# Altium project EDR_PCB_1.PrjPcb
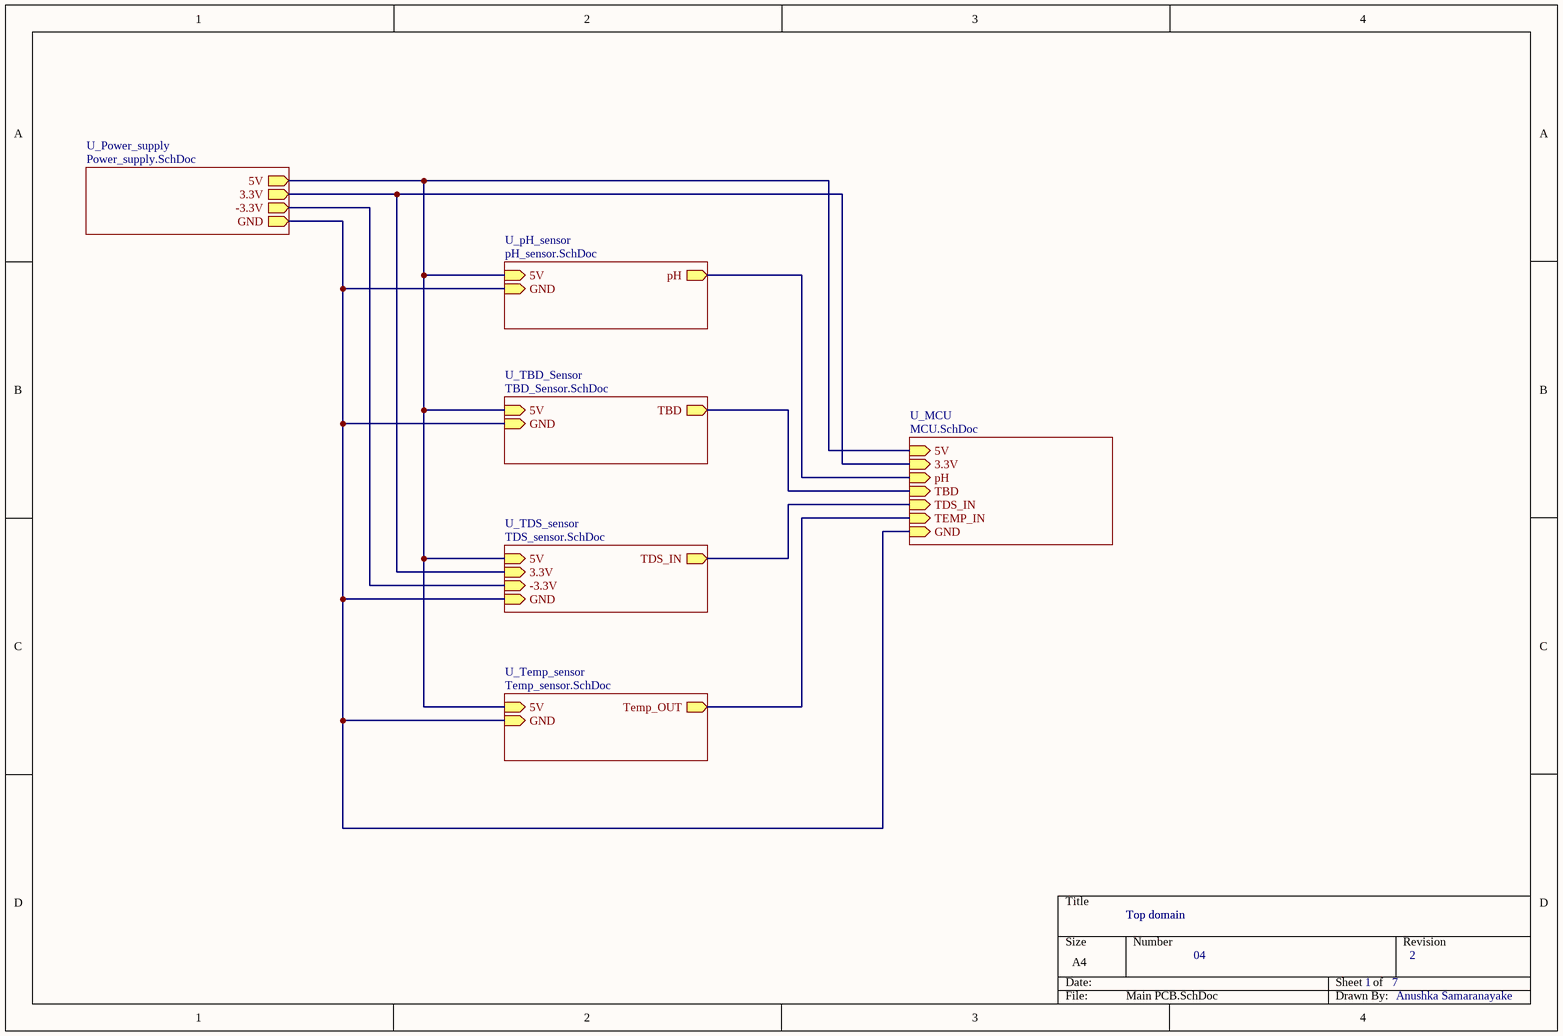
[diagram p0: Main PCB.SchDoc]
7 sheets, 114 parts. Net scope: hierarchical (ports join the sheet entries above them; power ports are global).
Board files: PCB2.PcbDoc, PCB1.PcbDoc
Sheets:
  Main PCB.SchDoc
    U_Power_supply = Power_supply.SchDoc
    U_pH_sensor = pH_sensor.SchDoc
    U_TBD_Sensor = TBD_Sensor.SchDoc
    U_TDS_sensor = TDS_sensor.SchDoc
    U_Temp_sensor = Temp_sensor.SchDoc
    U_MCU = MCU.SchDoc

## Sheet Main PCB.SchDoc
size A4; SheetNumber: 1; SheetTotal: 7

### Sub-sheets
U_MCU = MCU.SchDoc: 3.3V (in), GND (in), TEMP_IN (in), TBD (in), TDS_IN (in), pH (in), 5V (in)
U_pH_sensor = pH_sensor.SchDoc: 5V (in), pH (out), GND (in)
U_Power_supply = Power_supply.SchDoc: 5V (out), 3.3V (out), -3.3V (out), GND (out)
U_TBD_Sensor = TBD_Sensor.SchDoc: TBD (out), 5V (in), GND (in)
U_TDS_sensor = TDS_sensor.SchDoc: TDS_IN (out), 3.3V (in), -3.3V (in), 5V (in), GND (in)
U_Temp_sensor = Temp_sensor.SchDoc: Temp_OUT (out), 5V (in), GND (in)

### Nets
3.3V: sheet U_Power_supply/3.3V, sheet U_TDS_sensor/3.3V, sheet U_MCU/3.3V
5V: sheet U_Power_supply/5V, sheet U_pH_sensor/5V, sheet U_TBD_Sensor/5V, sheet U_TDS_sensor/5V, sheet U_Temp_sensor/5V, sheet U_MCU/5V
-3.3V: sheet U_Power_supply/-3.3V, sheet U_TDS_sensor/-3.3V
GND: sheet U_Power_supply/GND, sheet U_pH_sensor/GND, sheet U_TBD_Sensor/GND, sheet U_TDS_sensor/GND, sheet U_Temp_sensor/GND, sheet U_MCU/GND
p_AOUT: sheet U_pH_sensor/pH, sheet U_MCU/pH
Senser_OUT: sheet U_TBD_Sensor/TBD, sheet U_MCU/TBD
NetC25_2: sheet U_TDS_sensor/TDS_IN, sheet U_MCU/TDS_IN
NetMCU_17: sheet U_Temp_sensor/Temp_OUT, sheet U_MCU/TEMP_IN

### Notes on the sheet
- Top domain
- 04
- 1
- 7
- 2
- Anushka Samaranayake

## Sheet Power_supply.SchDoc
size A4; SheetNumber: 2; SheetTotal: 7
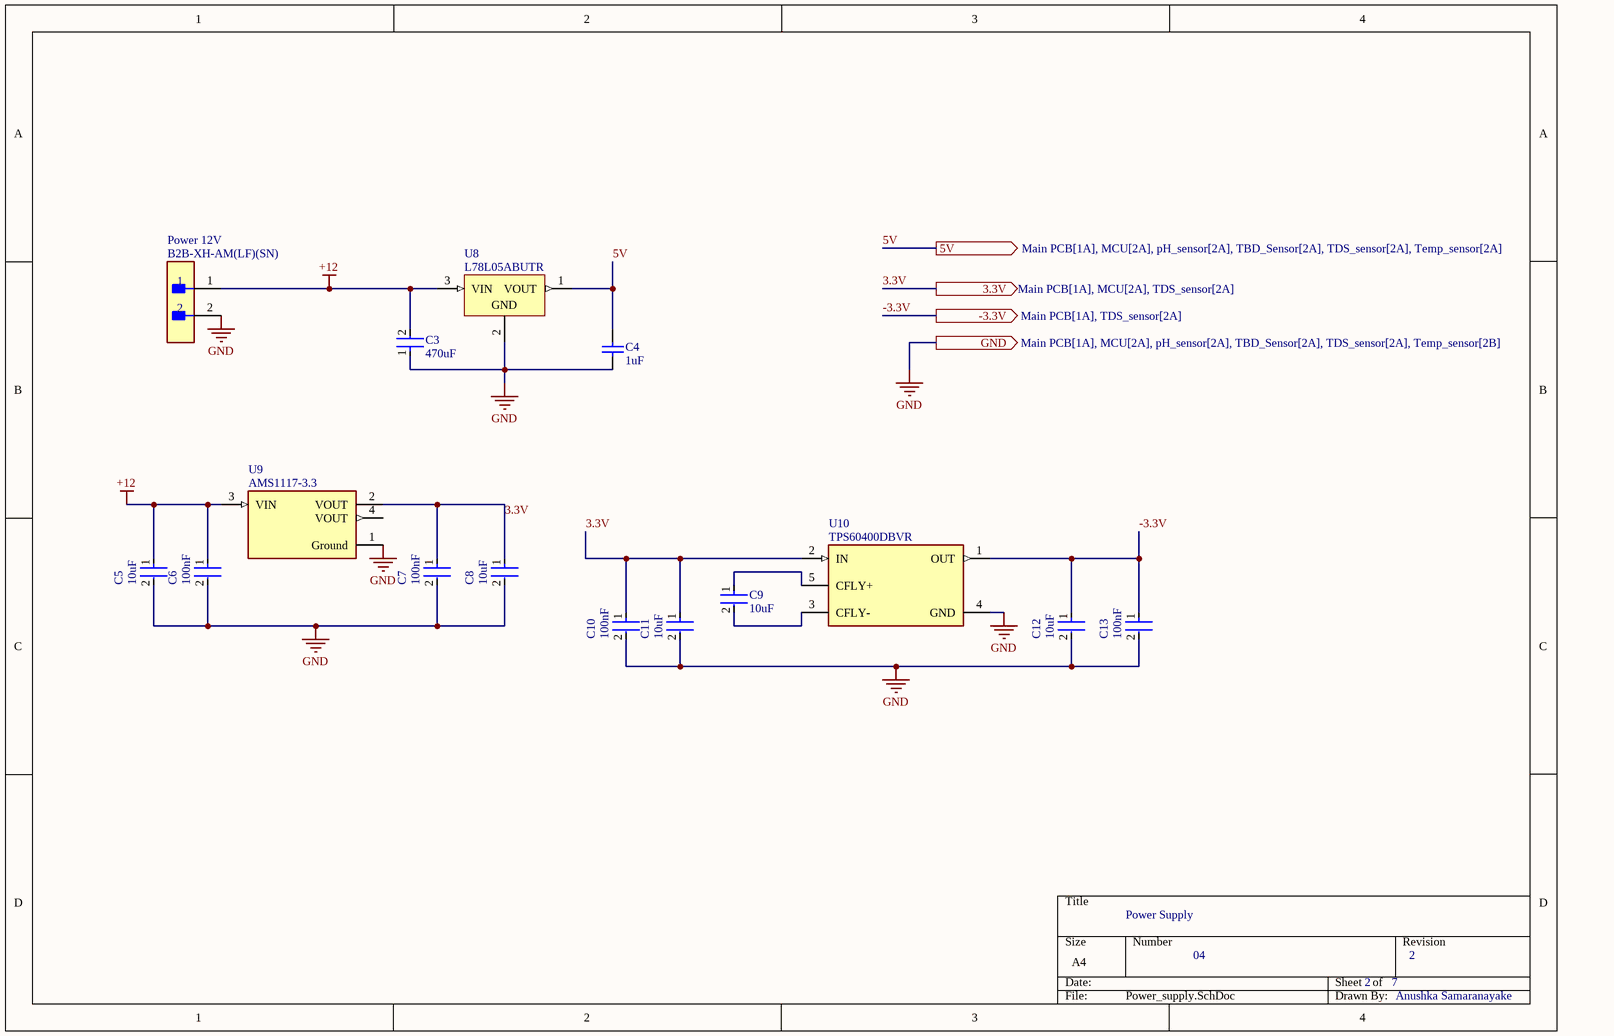
[diagram p1: Power_supply.SchDoc]

### Parts
C3  470uF  [FP-CL31-IPC_B]
C4  1uF  [CAPC2013X135X50LL15T20]
C5  10uF  [FP-CL31-IPC_B]
C6  100nF  [FP-CL31-IPC_B]
C7  100nF  [FP-CL31-IPC_B]
C8  10uF  [FP-CL31-IPC_B]
C9  10uF  [FP-CL31-IPC_B]
C10  100nF  [FP-CL31-IPC_B]
C11  10uF  [FP-CL31-IPC_B]
C12  10uF  [FP-CL31-IPC_B]
C13  100nF  [FP-CL31-IPC_B]
Power_12V  B2B-XH-AM(LF)(SN)  [FP-B2B-XH-AM_LF_SN-MFG]
U8  L78L05ABUTR  [SOT-89_N]
U9  AMS1117-3.3  [FP-AMS1117-IPC_C]
U10  TPS60400DBVR  [FP-DBV0005A-IPC_B]

### Ports
3.3V (out, see Main PCB[1A], MCU[2A], TDS_sensor[2A]), 5V (out, see Main PCB[1A], MCU[2A], pH_sensor[2A], TBD_Sensor[2A], TDS_sensor[2A], Temp_sensor[2A]), -3.3V (out, see Main PCB[1A], TDS_sensor[2A]), GND (out, see Main PCB[1A], MCU[2A], pH_sensor[2A], TBD_Sensor[2A], TDS_sensor[2A], Temp_sensor[2B])

### Nets
3.3V: C7.1 C8.1 C10.1 C11.1 U9.2(VOUT) U10.2(IN) ; port 3.3V
5V: C4.2 U8.1(VOUT) ; port 5V
+12: C3.2 C5.1 C6.1 Power_12V.1 U8.3(VIN) U9.3(VIN)
-3.3V: C12.1 C13.1 U10.1(OUT) ; port -3.3V
GND: C3.1 C4.1 C5.2 C6.2 C7.2 C8.2 C10.2 C11.2 C12.2 C13.2 Power_12V.2 U8.2(GND) U9.1(Ground) U10.4(GND) ; port GND
NetC9_1: C9.1 U10.5(CFLY+)
NetC9_2: C9.2 U10.3(CFLY-)

Not connected (* = marked no-connect by the designer): U9 4(VOUT)

### Notes on the sheet
- Power Supply
- 04
- 2
- 7
- Anushka Samaranayake

### Library data of the parts
C3 C5-C13 = CMP-13271-001731-1: Cap Ceramic 100nF 50V X7R ±10% SMD 1206 +125°C Embossed T/R; Voltage: 50V; Thickness: 0.037inch; Lead Free: Lead Free; Length: 3.2mm; Min Operating Temperature: -55°C; Package Quantity: 15000; Packaging: Tape and Reel; Mount: Surface Mount; Depth: 1.6mm; Case/Package: 1206; Voltage Rating (DC): 50V; Tolerance: 10%; Height: 0.85mm; Capacitance: 100nF; Radiation Hardening: No; Dielectric: X7R; Voltage Rating: 50V; Max Operating Temperature: 125°C; Width: 0.063inch
C4 = CMP-2007-03437-1: Manufacturer: Vitramon; Part Number: VJ0805Y102KXACW1BC
Power_12V = CMP-17439-000037-1: CONN HEADER VERT 2POS 2.5MM; Max Voltage Rating (AC): 250V; Connector Type: Male Pin; Contact Resistance: 20mR; Max Current Rating: 3A; Number of Positions: 2; Series: XH; Contact Material: Brass; Mount: Through Hole; Housing Material: Polyamide; Contact Plating: Tin; Termination: Solder; Max Operating Temperature: 85°C; Depth: 5.75mm; Packaging: Bulk; Min Operating Temperature: -25°C; Contact Type: Male Pin; Color: Green; Pitch: 2.5mm; Length: 7.4mm; Lead Free: Lead Free; Number of Rows: 1; Fastening Type: Detent; Housing Color: White; Orientation: Straight
U8 = CMP-0244-00406-1: Positive Voltage Regulator, 5V, 4-Pin SOT-89, Tape and Reel; PackageVersion: 2011; DatasheetVersion: 1/02/2011; PackageDescription: 3-Pin SOT-89 Package 1.5 mm Pitch, 4.1 mm Lead Span; PackageReference: SOT-89; ComponentLink2Description: Datasheet; ComponentLink1URL: http://www.st.com; ComponentLink1Description: Manufacturer URL; ComponentLink2URL: http://www.st.com/internet/com/TECHNICAL_RESOURCES/TECHNICAL_LITERATURE/DATASHEET/CD00000446.pdf
U9 = CMP-209535-000001-1: LDO Voltage Regulators 1A, 3.3V; Manufacturer: Advanced Monolithic Systems; Dropout Voltage: 1.1V; Output Type: Fixed; Nominal Supply Current: 5mA; Max Power Dissipation: 1.2W; Max Supply Voltage: 15V; Number Of Outputs: 1; Standoff Height: 0.64mm; Max Junction Temp: +125°C; Height: 1.8mm; Package: AMS1117; Device Class L2: Power Management ICs; ComponentLink2Description: Datasheet; ComponentLink2URL: http://www.advanced-monolithic.com/pdf/ds1117.pdf; Category: IC; RoHS: TRUE; Automotive: No; Device Class L1: Integrated Circuits (ICs); Output Current: 1A; Device Class L3: Voltage Regulators - Linear; Temperature: -40°C to +125°C; Output Voltage: 3.3V; Manufacturer Part Number: AMS1117-3.3; Temperature Range Low: -40°C; Octopart: https://octopart.com/ams1117-3.3-advanced+monolithic+systems-25899300; Lead Free: Yes; Ipc Land Pattern Name: SOT229P700X180-4; Temperature Range High: +125°C
U10 = CMP-0391-00019-3: IC REG CHARG PUMP INV 60MA SOT23; Number of Outputs: 1; Min Supply Voltage: 1.8V; Max Supply Voltage: 5.25V; Max Output Voltage: -5.25V; Operating Supply Current: 125uA; Logic Function: Inverting; Min Output Voltage: -1.6V; Output Type: Adjustable; Switching Frequency: 250kHz; Synchronous Rectifier: No; Min Operating Temperature: -40°C; Number of Pins: 5; Package Quantity: 3000; Min Input Voltage: 1.8V; Max Operating Temperature: 85°C; Packaging: Tape and Reel; Output Current: 60mA; Max Input Voltage: 5.25V; Weight: 0.000459oz; Lead Free: Lead Free; Output Voltage: -5.25V; Contact Plating: Gold; Radiation Hardening: No; Quiescent Current: 125uA; Max Output Current: 60mA; REACH SVHC: No SVHC; Case/Package: SOT-23-5

## Sheet pH_sensor.SchDoc
size A4; SheetNumber: 7; SheetTotal: 7
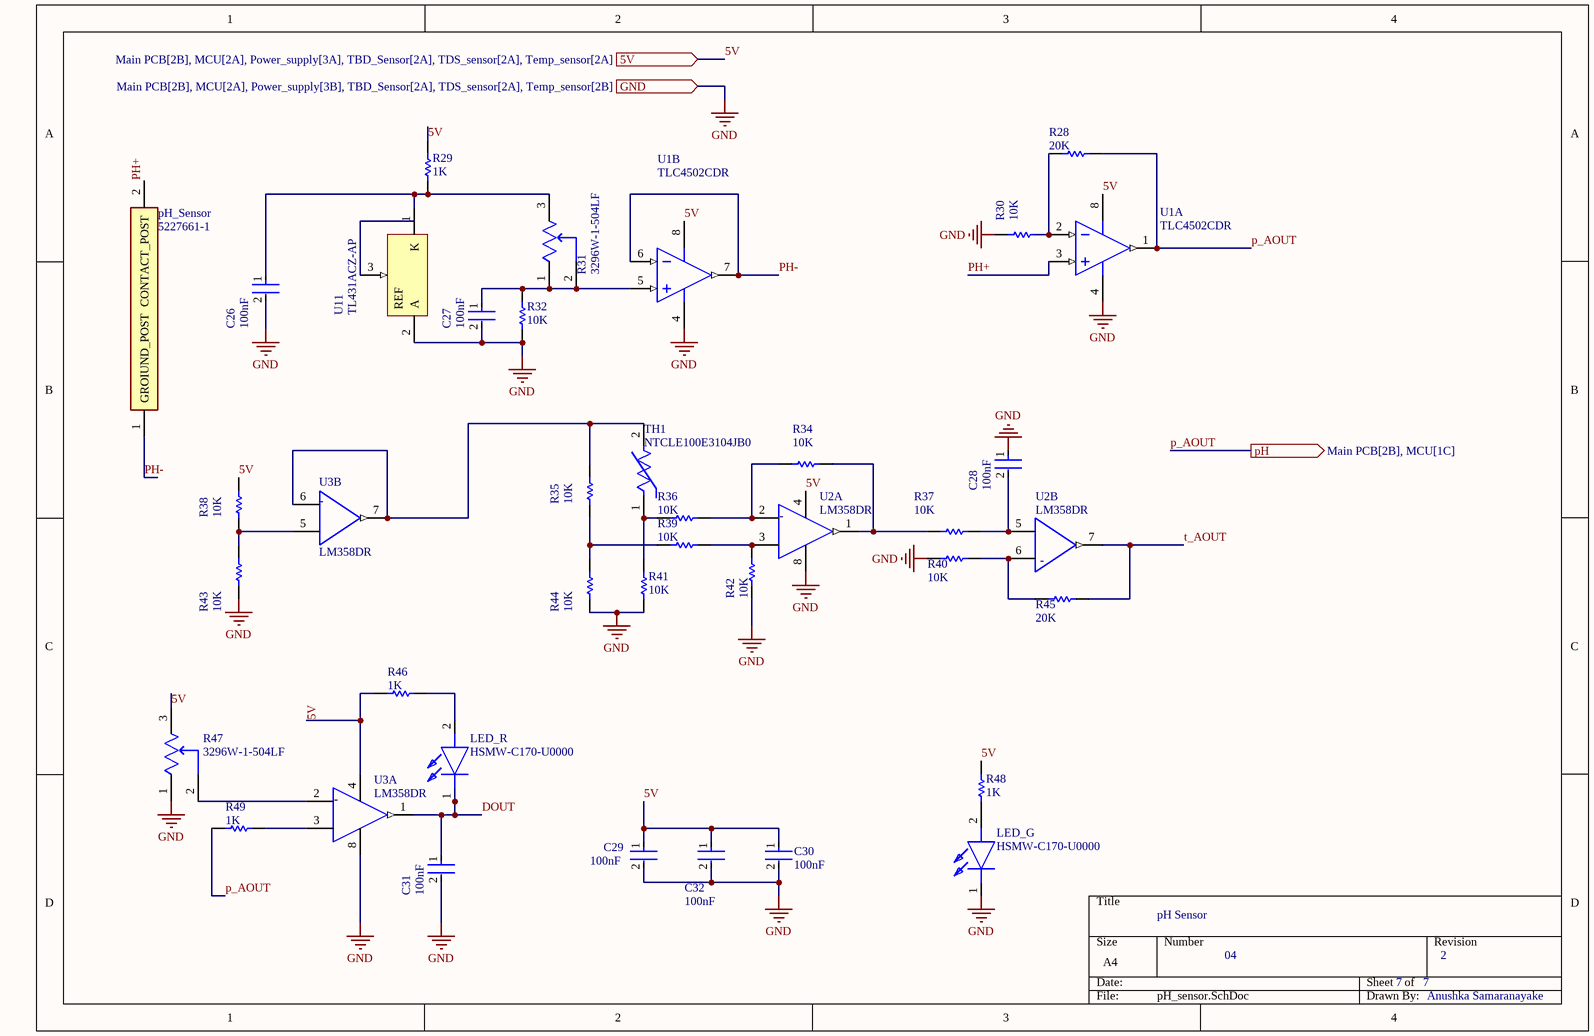
[diagram p2: pH_sensor.SchDoc]

### Parts
C26  100nF  [FP-CL31-IPC_B]
C27  100nF  [FP-CL31-IPC_B]
C28  100nF  [FP-CL31-IPC_B]
C29  100nF  [FP-CL31-IPC_B]
C30  100nF  [FP-CL31-IPC_B]
C31  100nF  [FP-CL31-IPC_B]
C32  100nF  [FP-CL31-IPC_B]
LED_G  HSMW-C170-U0000  [LEDC2012X90N]
LED_R  HSMW-C170-U0000  [LEDC2012X90N]
pH_Sensor  5227661-1  [5227161-1]
R28  20K  [RESC3216X70X50LL20T25]
R29  1K  [RESC3216X70X50ML20T25]
R30  10K  [RESC3216X70X50LL20T25]
R31  3296W-1-504LF  [FP-3296W-MFG]
R32  10K  [RESC3216X70X50LL20T25]
R34  10K  [RESC3216X70X50LL20T25]
R35  10K  [RESC3216X70X50LL20T25]
R36  10K  [RESC3216X70X50LL20T25]
R37  10K  [RESC3216X70X50LL20T25]
R38  10K  [RESC3216X70X50LL20T25]
R39  10K  [RESC3216X70X50LL20T25]
R40  10K  [RESC3216X70X50LL20T25]
R41  10K  [RESC3216X70X50LL20T25]
R42  10K  [RESC3216X70X50LL20T25]
R43  10K  [RESC3216X70X50LL20T25]
R44  10K  [RESC3216X70X50LL20T25]
R45  20K  [RESC3216X70X50LL20T25]
R46  1K  [RESC3216X70X50ML20T25]
R47  3296W-1-504LF  [FP-3296W-MFG]
R48  1K  [RESC3216X70X50ML20T25]
R49  1K  [RESC3216X70X50ML20T25]
TH1  NTCLE100E3104JB0  [FP-NTCLE100E3104JB0-MFG]
U1  TLC4502CDR  [D0008A_M]  (parts A,B of 2)
U2  LM358DR  [FP-D0008A-MFG]  (parts A,B of 2)
U3  LM358DR  [FP-D0008A-MFG]  (parts A,B of 2)
U11  TL431ACZ-AP  [TO-92]

### Ports
5V (in, see Main PCB[2B], MCU[2A], Power_supply[3A], TBD_Sensor[2A], TDS_sensor[2A], Temp_sensor[2A]), GND (in, see Main PCB[2B], MCU[2A], Power_supply[3B], TBD_Sensor[2A], TDS_sensor[2A], Temp_sensor[2B]), pH (out, see Main PCB[2B], MCU[1C])

### Nets
5V: C29.1 C30.1 C32.1 R29.1 R38.2 R46.1 R47.3(CW) R48.1 U1.8(VDD+) U2.4(V-) U3.4(V-) ; port 5V
GND: C26.2 C27.2 C28.1 C29.2 C30.2 C31.2 C32.2 LED_G.1(K) R30.1 R32.1 R40.1 R41.1 R42.1 R43.1 R44.1 R47.1(CCW) U1.4(VDD-/GND) U2.8(V+) U3.8(V+) U11.2(A) ; port GND
DOUT: C31.1 LED_R.1(K) U3.1(1OUT)
p_AOUT: R28.2 R49.1 U1.1(OUT1) ; port pH
PH+: pH_Sensor.2(CONTACT_POST) U1.3(IN1+)
PH-: pH_Sensor.1(GROIUND_POST) U1.6(IN2-) U1.7(OUT2)
t_AOUT: R45.2 U2.7(2OUT)
NetC26_1: C26.1 R29.2 R31.3(CW) U11.1(K)
NetC27_1: C27.1 R31.1(CCW) R31.2(WIPER) R32.2 U1.5(IN2+)
NetC28_2: C28.2 R37.2 U2.5(IN2+)
NetLED_G_2: LED_G.2(A) R48.2
NetLED_R_2: LED_R.2(A) R46.2
NetR28_1: R28.1 R30.2 U1.2(IN1-)
NetR34_1: R34.1 R36.2 U2.2(IN1-)
NetR34_2: R34.2 R37.1 U2.1(1OUT)
NetR35_1: R35.1 R39.1 R44.2
NetR35_2: R35.2 TH1.2 U3.6(IN2-) U3.7(2OUT)
NetR36_1: R36.1 R41.2 TH1.1
NetR38_1: R38.1 R43.2 U3.5(IN2+)
NetR39_2: R39.2 R42.2 U2.3(IN1+)
NetR40_2: R40.2 R45.1 U2.6(IN2-)
NetR47_2: R47.2(WIPER) U3.2(IN1-)
NetR49_2: R49.2 U3.3(IN1+)

Not connected (* = marked no-connect by the designer): U11 3(REF)

### Notes on the sheet
- pH Sensor
- 04
- 7
- 2
- Anushka Samaranayake
- (in symbol CMP-1685-00009-2, part A) -
- (in symbol CMP-1685-00009-2, part B) -

### Library data of the parts
C26-C32 = CMP-13271-001731-1: as C3 on sheet Power_supply; Voltage: 50V; Thickness: 0.037inch; Lead Free: Lead Free; Length: 3.2mm; Min Operating Temperature: -55°C; Package Quantity: 15000; Packaging: Tape and Reel; Mount: Surface Mount; Depth: 1.6mm; Case/Package: 1206; Voltage Rating (DC): 50V; Tolerance: 10%; Height: 0.85mm; Capacitance: 100nF; Radiation Hardening: No; Dielectric: X7R; Voltage Rating: 50V; Max Operating Temperature: 125°C; Width: 0.063inch
LED_G LED_R = HSMW-C170-U0000: LED; Manufacturer_Name: Avago Technologies; Datasheet Link: https://componentsearchengine.com/Datasheets/2/HSMW-C170-U0000.pdf; Height: 0.9mm; Manufacturer_Part_Number: HSMW-C170-U0000; Mouser Part Number: 630-HSMW-C170-U0000; Mouser Price/Stock: https://www.mouser.co.uk/ProductDetail/Broadcom-Avago/HSMW-C170-U0000?qs=tMOYG%252Bw4%252BLwGyeHODzQdug%3D%3D
pH_Sensor = 5227661-1: Connector; Manufacturer_Name: TE Connectivity; Datasheet Link: https://www.te.com/commerce/DocumentDelivery/DDEController?Action=srchrtrv&DocNm=1307191_BNC_Connectors&DocType=Catalog%20Section&DocLang=English&PartCntxt=5227661-1&DocFormat=pdf; Manufacturer_Part_Number: 5227661-1; Mouser Part Number: 571-5227661-1; Mouser Price/Stock: https://www.mouser.co.uk/ProductDetail/TE-Connectivity/5227661-1?qs=GSeC4G%252BEqEUTcTZ6HpL7ew%3D%3D; Arrow Part Number: 5227661-1; Arrow Price/Stock: https://www.arrow.com/en/products/5227661-1/te-connectivity?region=nac
R28 R30 R32 R34-R45 = CMP-2003-04407-1: Manufacturer: Panasonic; Part Number: ERA8AEB103V
R29 R46 R48 R49 = CMP-2003-04406-1: Part Number: ERA8AEB102V; Manufacturer: Panasonic
R31 R47 = CMP-2000-05583-2: TRIMMER 500K OHM 0.5W PC PIN TOP; Manufacturer: Bourns; Resistance: 500kΩ; Temperature Coefficient: 100ppm/°C; Value: 500kΩ; Tolerance: 10%; Voltage Rating: 300V; Standoff Height: 0.38mm; ComponentLink2Description: Datasheet; Package: 3296W; Series: Trimpot 3296-Sealed; Lead Free: Yes; Octopart: https://octopart.com/3296w-1-504lf-bourns-143884; Device Class L2: Resistors; Automotive: No; RoHS: TRUE; Temperature Range High: +125°C; Manufacturer Part Number: 3296W-1-504LF; Height: 12.05mm; Power Rating: 0.5W; Temperature Range Low: -55°C; ComponentLink2URL: https://www.bourns.com/docs/Product-Datasheets/3296.pdf; Device Class L1: Passive Components; Device Class L3: Variable Resistors and Potentiometers; Category: Res; Temperature: -55°C to +125°C; Digikey Description: TRIMMER 500K OHM 0.5W PC PIN TOP; Mouser Description: Trimmer; Cermet; Rest 500 Kilohms; PCB; 25 Turns; Pwr-Rtg 0.5W
TH1 = CMP-02404-000021-1: NTC THERMISTOR 100K OHM 5% BEAD; Lead Diameter: 0.6mm; Accuracy: 1.5%; Max Power Dissipation: 500mW; Lead Length: 17mm; Resistance: 100kR; Package Quantity: 500; Resistance Tolerance: 5%; Height: 9mm; Case/Package: Radial; Depth: 3mm; Lead Free: Lead Free; Tolerance: 5%; Number of Pins: 2; RoHS Compliant: Yes; Lead Pitch: 2.54mm; Min Operating Temperature: -40°C; Termination: Radial; Series: 2322; Length: 3.3mm; Radiation Hardening: No; Mount: Through Hole; Max Operating Temperature: 125°C; Packaging: Bulk
U1 = CMP-0271-00178-3: Advanced LinEPIC Self-Calibrating Precision Dual Operational Amplifier, 4 to 6 V, 0 to 70 degC, 8-pin SOIC (D8), Green (RoHS & no Sb/Br); Manufacturer: Texas Instruments; Total Supply Voltage(Min)(+5V is 5, +/-5V is 10): 4; Slew Rate(Typ)(V/us): 2.5; Iq per channel(Max)(mA): 3.5; Vn at 1kHz(Typ)(nV/rtHz): 12; CMRR(Min)(dB): 90; Number of Channels: 2; Vio (25C)(Max)(mV): 0.1; Offset Drift(Typ)(uV/C): 1; IIB(Max)(pA): 60; Sub Family: Low Offset Voltage Amplifier (<=500uV), Precision Amplifier; Total Supply Voltage(Max)(+5V is 5, +/-5V is 10): 6; ComponentLink1Description: Manufacturer URL; DatasheetVersion: SLOS221B; PackageDescription: 8-Pin Plastic Small Outline, Body 4.9 x 3.9 mm, Pitch 1.27 mm; Eco-Plan: Green (RoHS & no Sb/Br); Code_JEDEC: MS-012; ComponentLink3URL: http://www.ti.com/litv/pdf/msoi002j; ComponentLink3Description: Package Specification; ComponentLink1URL: http://www.ti.com/; PackageVersion: 4040047-3/M, 06/2011; PartNumber: TLC4502CDR; ComponentLink2Description: Datasheet; PackageReference: D0008A; ComponentLink2URL: http://www.ti.com/general/docs/lit/getliterature.tsp?genericPartNumber=TLC4502&fileType=pdf; Mounting Technology: Surface Mount
U2 U3 = CMP-1685-00009-2: IC OPAMP GP 2 CIRCUIT 8SOIC; Output Current: 30mA; Min Dual Supply Voltage: 1.5V; Input Offset Voltage (Vos): 7mV; Power Supply Rejection Ratio (PSRR): 65dB; Unity Gain Bandwidth Product: 700kHz; Number of Channels: 2; Min Supply Voltage: 3V; Max Dual Supply Voltage: 16V; Dual Supply Voltage: 9V; Max Supply Voltage: 32V; Nominal Supply Current: 1.2mA; Slew Rate: 0.3V/µs; Input Bias Current: 250nA; Voltage Gain: 100dB; Operating Supply Current: 1mA; REACH SVHC: No SVHC; Package Quantity: 2500; Width: 3.91mm; Max Operating Temperature: 70°C; Min Operating Temperature: 0°C; Mount: Surface Mount; Length: 4.9mm; Radiation Hardening: No; Case/Package: SOIC; Lead Free: Lead Free; Number of Elements: 2; Packaging: Tape and Reel; Output Current per Channel: 30mA; Number of Circuits: 2; Bandwidth: 700kHz; Operating Supply Voltage: 16V; Gain Bandwidth Product: 700kHz; Number of Pins: 8; Number of Amplifiers: 2; Height: 1.58mm; Common Mode Rejection Ratio: 65dB; Contact Plating: Gold
U11 = CMP-0242-00005-1: Programmable Voltage Reference, 2.5 to 36V, 3-Pin TO-92, Ammopak; ComponentLink2URL: http://www.st.com/internet/com/TECHNICAL_RESOURCES/TECHNICAL_LITERATURE/DATASHEET/CD00000986.pdf; PackageDescription: TO, Flat Index; 3 In-Line, Axial Leads; Body Dia. 4.7mm; Lead Dia. 0.56 mm (max); DatasheetVersion: Oct-2011; ComponentLink1URL: http://www.st.com; ComponentLink1Description: Manufacturer URL; PackageVersion: 2011; ComponentLink2Description: Datasheet; PackageReference: TO-92

## Sheet TBD_Sensor.SchDoc
size A4; SheetNumber: 5; SheetTotal: 7
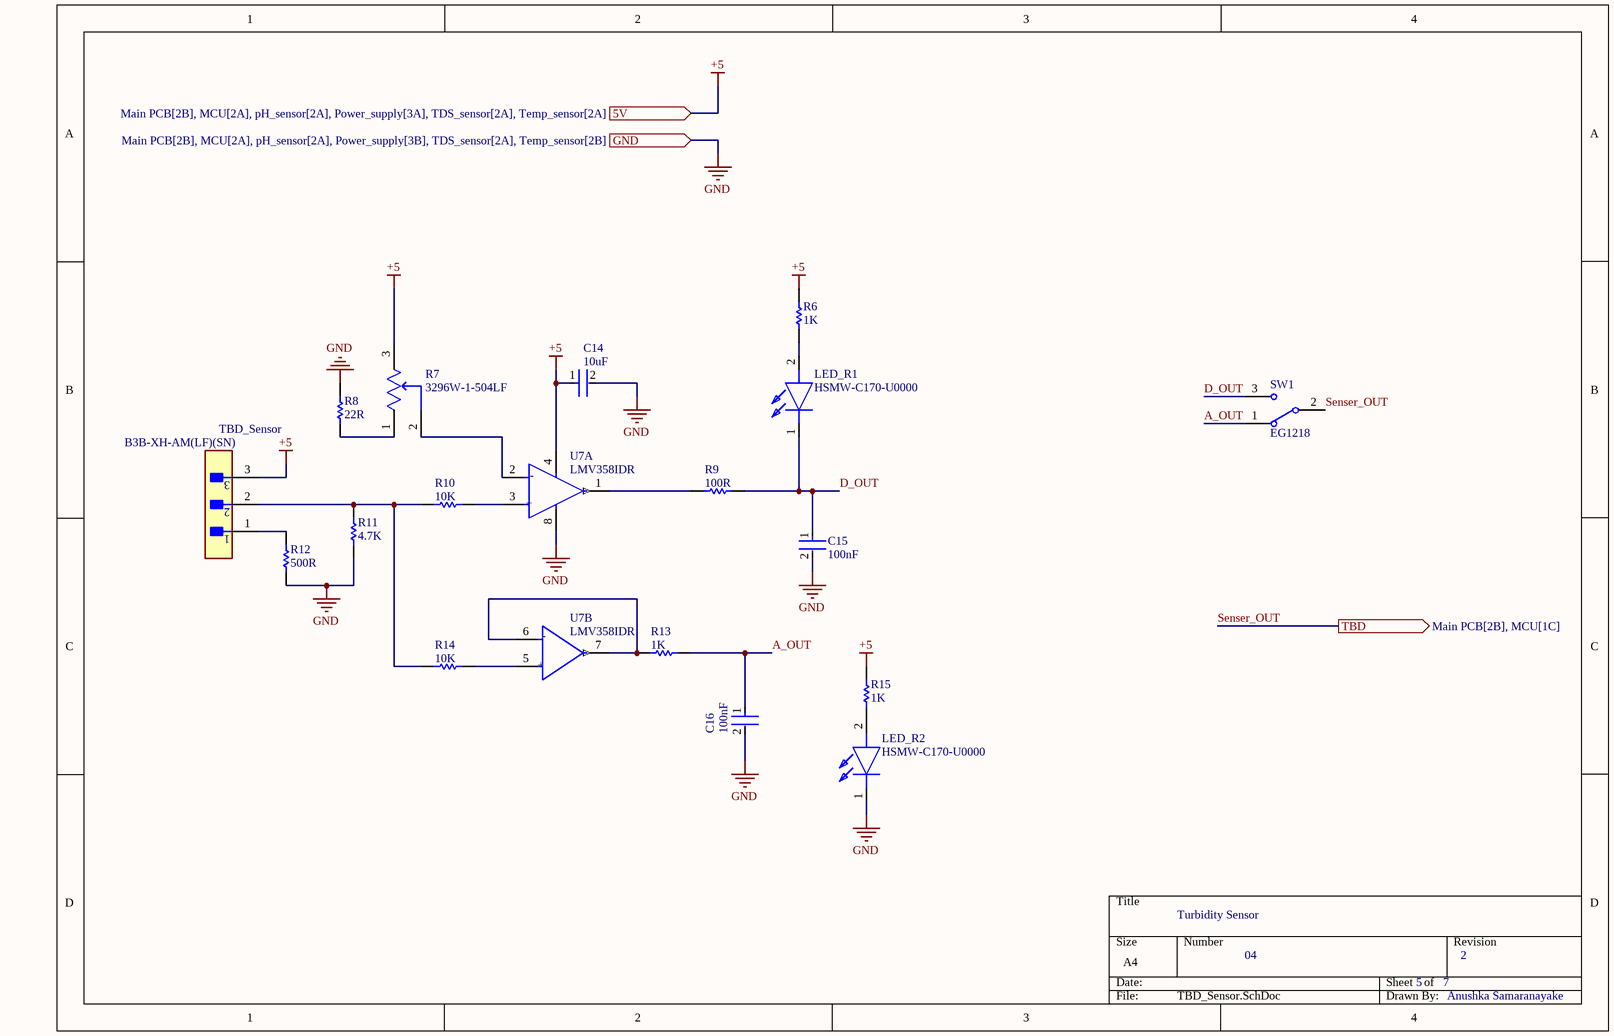
[diagram p3: TBD_Sensor.SchDoc]

### Parts
C14  10uF  [FP-CL31-IPC_B]
C15  100nF  [FP-CL31-IPC_B]
C16  100nF  [FP-CL31-IPC_B]
LED_R1  HSMW-C170-U0000  [LEDC2012X90N]
LED_R2  HSMW-C170-U0000  [LEDC2012X90N]
R6  1K  [RESC3216X70X50LL20T25]
R7  3296W-1-504LF  [FP-3296W-MFG]
R8  22R  [RESC2013X60X35ML10T20]
R9  100R  [RESC2013X60X35ML10T20]
R10  10K  [RESC3216X70X50LL20T25]
R11  4.7K  [RESC3216X70X50LL20T25]
R12  500R  [RESC2013X60X35ML10T20]
R13  1K  [RESC3216X70X50LL20T25]
R14  10K  [RESC3216X70X50LL20T25]
R15  1K  [RESC3216X70X50LL20T25]
SW1  EG1218  [ESWI-EG1218_V]
TBD_Sensor  B3B-XH-AM(LF)(SN)  [FP-B3B-XH-AM_LF_SN-MFG]
U7  LMV358IDR  [FP-D0008A-MFG]  (parts A,B of 2)

### Ports
5V (in, see Main PCB[2B], MCU[2A], pH_sensor[2A], Power_supply[3A], TDS_sensor[2A], Temp_sensor[2A]), GND (in, see Main PCB[2B], MCU[2A], pH_sensor[2A], Power_supply[3B], TDS_sensor[2A], Temp_sensor[2B]), TBD (out, see Main PCB[2B], MCU[1C])

### Nets
+5: C14.1 R6.1 R7.3(CW) R15.1 TBD_Sensor.3 U7.4(GND) ; port 5V  [project net 5V]
GND: C14.2 C15.2 C16.2 LED_R2.1(K) R8.2 R11.2 R12.1 U7.8(VCC+) ; port GND
A_OUT: C16.1 R13.1 SW1.1
D_OUT: C15.1 LED_R1.1(K) R9.2 SW1.3
Senser_OUT: SW1.2(COM) ; port TBD
NetLED_R1_2: LED_R1.2(A) R6.2
NetLED_R2_2: LED_R2.2(A) R15.2
NetR7_1: R7.1(CCW) R8.1
NetR7_2: R7.2(WIPER) U7.2(1IN-)
NetR9_1: R9.1 U7.1(OUT)
NetR10_1: R10.1 U7.3(1IN+)
NetR10_2: R10.2 R11.1 R14.2 TBD_Sensor.2
NetR12_2: R12.2 TBD_Sensor.1
NetR13_2: R13.2 U7.6(2IN-) U7.7(2OUT)
NetR14_1: R14.1 U7.5(2IN+)

### Notes on the sheet
- Turbidity Sensor
- 04
- 5
- 7
- 2
- Anushka Samaranayake
- (in symbol CMP-04895-000136-1, part A) -; +
- (in symbol CMP-04895-000136-1, part B) -; +

### Library data of the parts
C14-C16 = CMP-13271-001731-1: as C3 on sheet Power_supply; Voltage: 50V; Thickness: 0.037inch; Lead Free: Lead Free; Length: 3.2mm; Min Operating Temperature: -55°C; Package Quantity: 15000; Packaging: Tape and Reel; Mount: Surface Mount; Depth: 1.6mm; Case/Package: 1206; Voltage Rating (DC): 50V; Tolerance: 10%; Height: 0.85mm; Capacitance: 100nF; Radiation Hardening: No; Dielectric: X7R; Voltage Rating: 50V; Max Operating Temperature: 125°C; Width: 0.063inch
LED_R1 LED_R2 = HSMW-C170-U0000: as LED_G on sheet pH_sensor; Datasheet Link: https://componentsearchengine.com/Datasheets/2/HSMW-C170-U0000.pdf; Height: 0.9mm; Manufacturer_Part_Number: HSMW-C170-U0000; Mouser Part Number: 630-HSMW-C170-U0000; Mouser Price/Stock: https://www.mouser.co.uk/ProductDetail/Broadcom-Avago/HSMW-C170-U0000?qs=tMOYG%252Bw4%252BLwGyeHODzQdug%3D%3D
R6 R10 R11 R13-R15 = CMP-2003-04407-1: as R28 on sheet pH_sensor
R7 = CMP-2000-05583-2: as R31 on sheet pH_sensor; ComponentLink2Description: Datasheet; Package: 3296W; Series: Trimpot 3296-Sealed; Lead Free: Yes; Octopart: https://octopart.com/3296w-1-504lf-bourns-143884; Device Class L2: Resistors; Automotive: No; RoHS: TRUE; Temperature Range High: +125°C; Manufacturer Part Number: 3296W-1-504LF; Height: 12.05mm; Power Rating: 0.5W; Temperature Range Low: -55°C; ComponentLink2URL: https://www.bourns.com/docs/Product-Datasheets/3296.pdf; Device Class L1: Passive Components; Device Class L3: Variable Resistors and Potentiometers; Category: Res; Temperature: -55°C to +125°C; Digikey Description: TRIMMER 500K OHM 0.5W PC PIN TOP; Mouser Description: Trimmer; Cermet; Rest 500 Kilohms; PCB; 25 Turns; Pwr-Rtg 0.5W
R8 R9 R12 = CMP-2100-03671-1: Chip Resistor, 1 KOhm, +/- 1%, 125 mW, -55 to 155 degC, 0805 (2012 Metric), RoHS, Tape and Reel; Manufacturer: Yageo; Temperature Coefficient: 100ppm/degreesC; Voltage Rating (DC): 150V; Max Power Dissipation: 125mW; Resistance: 1KOhm; Number of Pins: 2; Number of Terminations: 2; Datasheet URL: http://www.yageo.com/NewPortal/yageodocoutput?fileName=/pdf/R-Chip/PYu-RC_Group_51_RoHS_L_5.pdf; Length: 0.079inch; Package Description: 2-Pin Surface Mounted Device, Body 2 x 1.25 mm; Depth: 1.25mm; Height: 0.024inch; Military Standard: Not; Case/Package: 0805; Package Reference: 0805; RoHSCompliant: true; Lead Free: LeadFree; Packaging: TapeandReel; Package Quantity: 1; Datasheet Version: Rev. 5, 10/2016; Tolerance: 1%; Min Operating Temperature: -55degC; Voltage Rating: 150V; Composition: ThickFilm; Case Code (Imperial): 0805; Power Rating: 125mW; Width: 0.049inch; Case Code (Metric): 2012; Manufacturer URL: http://www.yageo.com/; Max Operating Temperature: 155degC; REACH SVHC: Unknown; Termination: SMD/SMT
SW1 = CMP-1696-00002-1: Slide Switch, 500 V, -20 to 70 degC, 3-Pin THD, RoHS; Case\Package: SOT-23-5; Output Current: 150 mA; Nominal Output Voltage: 3.3 V; Max Power Dissipation: 250 mW; Min Input Voltage: 4.3 V; Outputs: 1; Max Input Voltage: 8 V; Dropout Voltage: 300 mV; PackageDescription: 3-Pin Through Hole Device, Body 11.6 x 4 mm, Pitch 2.5 mm; ComponentLink1URL: http://www.e-switch.ch/en/; RoHSCompliant: true; Length: 3 mm; ComponentLink1Description: Manufacturer URL; Power Rating: 250 mW; Mount: Surface Mount; Max Operating Temperature: 85 degC; REACH SVHC: No SVHC; Radiation Hardening: No; Height: 1.3 mm; Pins: 5; Max Ouput Current: 150 mA; Output Voltage: 3.3 V; Width: 1.8 mm; Package Quantity: 3000; ComponentLink2URL: https://www.e-switch.com/system/asset/product_line/data_sheet/119/EG.pdf; Min Operating Temperature: -40 degC; ComponentLink2Description: Datasheet; DatasheetVersion: Oct-15; PackageReference: EG1218; Packaging: Tape and Reel
TBD_Sensor = CMP-17438-000009-1: CONN HEADER VERT 3POS 2.5MM; Max Current Rating: 3A; Gender: Male; Max Voltage Rating (AC): 250V; Connector Type: Male Pin; Pitch: 0.098inch; Number of Positions: 3; Contact Resistance: 20mR; Termination: Press-Fit; Housing Color: White; Housing Material: Polyamide; Orientation: Straight; Contact Material: Brass; Contact Type: Male Pin; Color: Natural; Packaging: Bulk; Lead Free: Lead Free; Depth: 5.75mm; Number of Rows: 1; Contact Plating: Tin; Length: 9.9mm; Max Operating Temperature: 85°C; Series: XH; Min Operating Temperature: -25°C; Fastening Type: Detent; Mount: Through Hole
U7 = CMP-04895-000136-1: IC OPAMP GP 2 CIRCUIT 8SOIC; Number of Elements: 2; Min Supply Voltage: 2.7V; Input Bias Current: 250nA; Output Current per Channel: 160mA; Bandwidth: 1MHz; Voltage Gain: 100dB; Input Offset Voltage (Vos): 7mV; Slew Rate: 1V/µs; Nominal Supply Current: 440uA; Power Supply Rejection Ratio (PSRR): 50dB; Max Supply Voltage: 5.5V; Operating Supply Current: 210uA; Lead Free: Lead Free; Length: 4.9mm; RoHS Compliant: Yes; REACH SVHC: No SVHC; Case/Package: SOIC; Height: 1.58mm; Number of Channels: 2; Number of Amplifiers: 2; Radiation Hardening: No; Number of Circuits: 2; Mount: Surface Mount; Contact Plating: Gold; Unity Gain Bandwidth Product: 1MHz; Min Operating Temperature: -40°C; Max Operating Temperature: 125°C; Width: 3.91mm; Gain Bandwidth Product: 1MHz; Number of Pins: 8; Packaging: Tape and Reel; Package Quantity: 2500; Output Current: 160mA; Common Mode Rejection Ratio: 50dB

## Sheet TDS_sensor.SchDoc
size A4; SheetNumber: 6; SheetTotal: 7
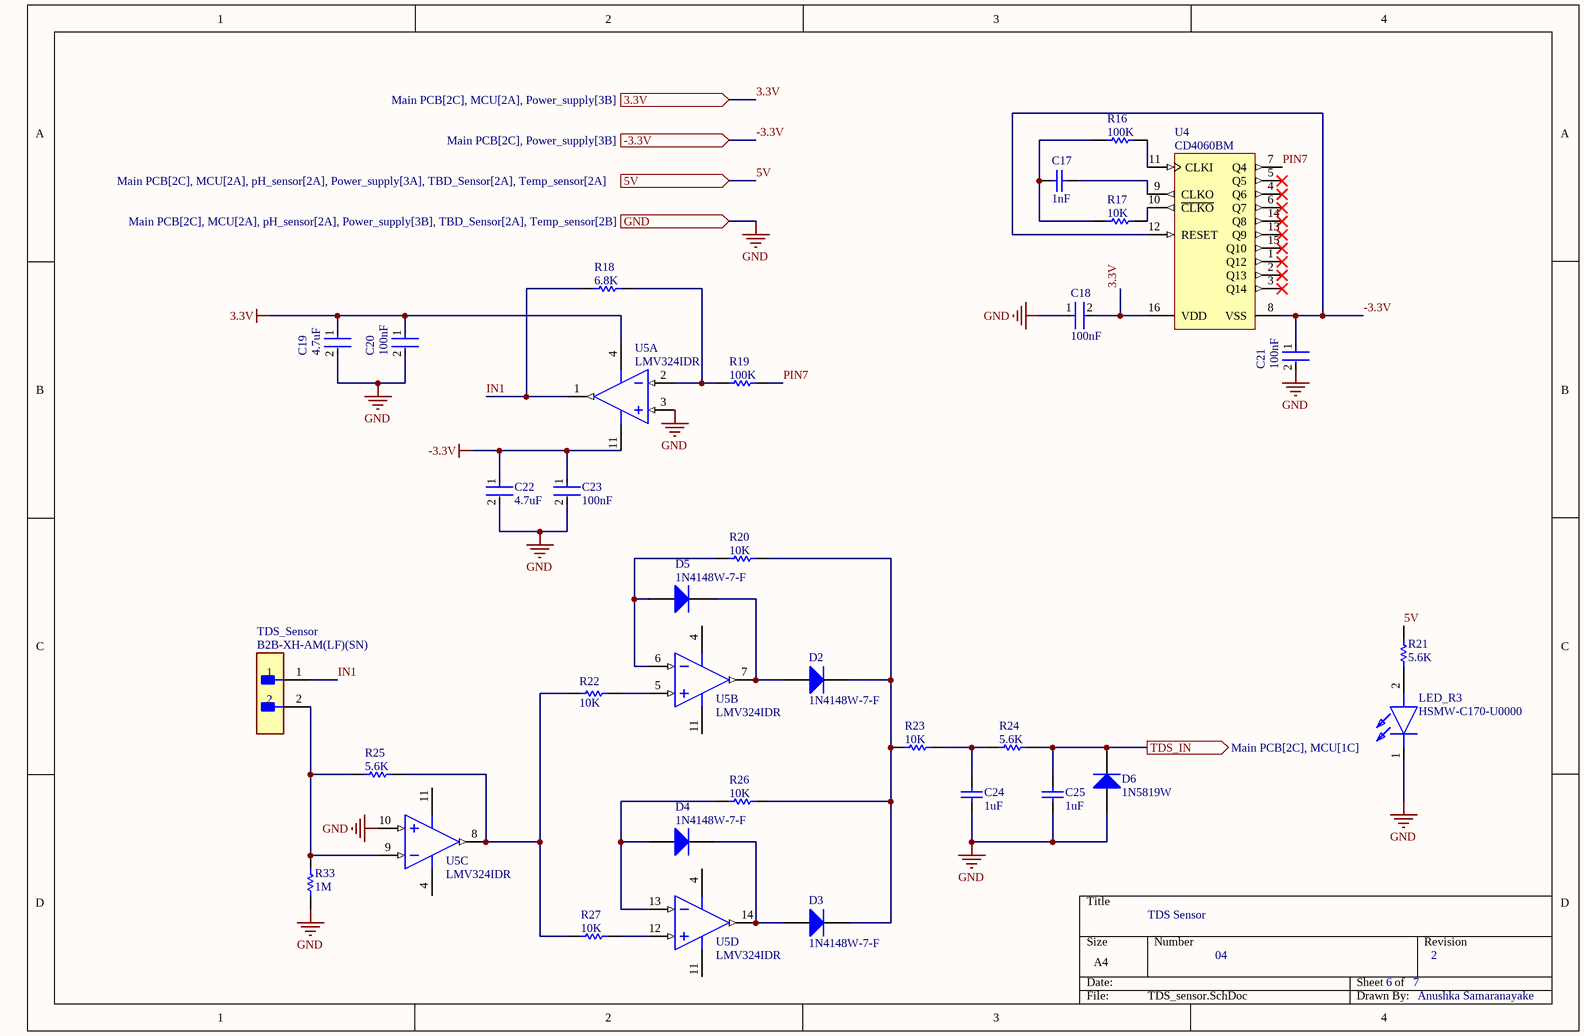
[diagram p4: TDS_sensor.SchDoc]

### Parts
C17  1nF  [CAPC2013X135X50LL15T20]
C18  100nF  [FP-CL31-IPC_B]
C19  4.7uF  [FP-CL31-IPC_B]
C20  100nF  [FP-CL31-IPC_B]
C21  100nF  [FP-CL31-IPC_B]
C22  4.7uF  [FP-CL31-IPC_B]
C23  100nF  [FP-CL31-IPC_B]
C24  1uF  [CAPC2013X135X50LL15T20]
C25  1uF  [CAPC2013X135X50LL15T20]
D2  1N4148W-7-F  [DIOD-SOD123-2_V]
D3  1N4148W-7-F  [DIOD-SOD123-2_V]
D4  1N4148W-7-F  [DIOD-SOD123-2_V]
D5  1N4148W-7-F  [DIOD-SOD123-2_V]
D6  1N5819W  [DIOD-SOD123-2_V]
LED_R3  HSMW-C170-U0000  [LEDC2012X90N]
R16  100K  [RESC3216X70X50LL20T25]
R17  10K  [RESC3216X70X50LL20T25]
R18  6.8K  [RESC3216X70X50LL20T25]
R19  100K  [RESC3216X70X50LL20T25]
R20  10K  [RESC3216X70X50LL20T25]
R21  5.6K  [RESC3216X70X50LL20T25]
R22  10K  [RESC3216X70X50LL20T25]
R23  10K  [RESC3216X70X50LL20T25]
R24  5.6K  [RESC3216X70X50LL20T25]
R25  5.6K  [RESC3216X70X50LL20T25]
R26  10K  [RESC3216X70X50LL20T25]
R27  10K  [RESC3216X70X50LL20T25]
R33  1M  [RESC3216X70X50LL20T25]
TDS_Sensor  B2B-XH-AM(LF)(SN)  [FP-B2B-XH-AM_LF_SN-MFG]
U4  CD4060BM  [D0016A_M]
U5  LMV324IDR  [D0014A_V]  (parts A,B,C,D of 4)

### Ports
3.3V (in, see Main PCB[2C], MCU[2A], Power_supply[3B]), 5V (in, see Main PCB[2C], MCU[2A], pH_sensor[2A], Power_supply[3A], TBD_Sensor[2A], Temp_sensor[2A]), -3.3V (in, see Main PCB[2C], Power_supply[3B]), GND (in, see Main PCB[2C], MCU[2A], pH_sensor[2A], Power_supply[3B], TBD_Sensor[2A], Temp_sensor[2B]), TDS_IN (out, see Main PCB[2C], MCU[1C])

### Nets
3.3V: C18.2 C19.1 C20.1 U4.16(VDD) U5.4(VCC+) ; port 3.3V
5V: R21.1 ; port 5V
-3.3V: C21.1 C22.1 C23.1 U4.8(VSS) U4.12(RESET) U5.11(GND) ; port -3.3V
GND: C18.1 C19.2 C20.2 C21.2 C22.2 C23.2 C24.1 C25.1 D6.1(A) LED_R3.1(K) R33.2 U5.3(1IN+) U5.10(3IN+) ; port GND
IN1: R18.2 TDS_Sensor.1 U5.1(1OUT)
PIN7: R19.1 U4.7(Q4)
NetC17_1: C17.1 R16.2 R17.2
NetC17_2: C17.2 U4.9(CLKO)
NetC24_2: C24.2 R23.1 R24.2
NetC25_2: C25.2 D6.2(K) R24.1 ; port TDS_IN
NetD2_1: D2.1(A) D5.2(K) U5.7(2OUT)
NetD2_2: D2.2(K) D3.2(K) R20.1 R23.2 R26.1
NetD3_1: D3.1(A) D4.2(K) U5.14(4OUT)
NetD4_1: D4.1(A) R26.2 U5.13(4IN-)
NetD5_1: D5.1(A) R20.2 U5.6(2IN-)
NetLED_R3_2: LED_R3.2(A) R21.2
NetR16_1: R16.1 U4.11(CLKI)
NetR17_1: R17.1 U4.10(~{CLKO})
NetR18_1: R18.1 R19.2 U5.2(1IN-)
NetR22_1: R22.1 U5.5(2IN+)
NetR22_2: R22.2 R25.1 R27.2 U5.8(3OUT)
NetR25_2: R25.2 R33.1 TDS_Sensor.2 U5.9(3IN-)
NetR27_1: R27.1 U5.12(4IN+)

Not connected (* = marked no-connect by the designer): U4 1(Q12)* 2(Q13)* 3(Q14)* 4(Q6)* 5(Q5)* 6(Q7)* 13(Q9)* 14(Q8)* 15(Q10)*

### Notes on the sheet
- TDS Sensor
- 04
- 6
- 7
- 2
- Anushka Samaranayake

### Library data of the parts
C17 C24 C25 = CMP-2007-03437-1: as C4 on sheet Power_supply
C18-C23 = CMP-13271-001731-1: as C3 on sheet Power_supply; Voltage: 50V; Thickness: 0.037inch; Lead Free: Lead Free; Length: 3.2mm; Min Operating Temperature: -55°C; Package Quantity: 15000; Packaging: Tape and Reel; Mount: Surface Mount; Depth: 1.6mm; Case/Package: 1206; Voltage Rating (DC): 50V; Tolerance: 10%; Height: 0.85mm; Capacitance: 100nF; Radiation Hardening: No; Dielectric: X7R; Voltage Rating: 50V; Max Operating Temperature: 125°C; Width: 0.063inch
D2-D6 = CMP-2000-04932-2: Fast Switching Diode, 100 V, 0.15 A, -65 to 150 degC, 2-Pin?SOD123, RoHS, Tape and Reel; Recovery Time: 4ns; Brand: DiodesIncorporated; Unit Weight: 0.000353oz; Max Surge Current: 2A; Peak Reverse Voltage: 100V; Ir - Reverse Current: 1uA; Vf - Forward Voltage: 1.25V; Configuration: Single; If - Forward Current: 0.15A; Product Category: Diodes-GeneralPurpose,Power,Switching; Operating Temperature Range: -65Cto+150C; Packaging: Reel; Manufacturer URL: http://www.diodes.com/; Maximum Operating Temperature: +150C; Height: 1.25mm; Minimum Operating Temperature: -65C; Product: SwitchingDiodes; Package URL: http://www.diodes.com/datasheets/ds18004.pdf; Type: SwitchingDiode; Package Reference: SOD123-2; Width: 1.7mm; Datasheet URL: http://www.farnell.com/datasheets/1915529.pdf; Datasheet Version: Rev. 24-2, 10/2013; Series: 1N4148; Factory Pack Quantity: 3000; Length: 2.85mm; RoHS: True; Manufacturer: DiodesIncorporated; Mounting Style: SMD/SMT; Package / Case: SOD-123
LED_R3 = HSMW-C170-U0000: as LED_G on sheet pH_sensor; Datasheet Link: https://componentsearchengine.com/Datasheets/2/HSMW-C170-U0000.pdf; Height: 0.9mm; Manufacturer_Part_Number: HSMW-C170-U0000; Mouser Part Number: 630-HSMW-C170-U0000; Mouser Price/Stock: https://www.mouser.co.uk/ProductDetail/Broadcom-Avago/HSMW-C170-U0000?qs=tMOYG%252Bw4%252BLwGyeHODzQdug%3D%3D
R16-R27 R33 = CMP-2003-04407-1: as R28 on sheet pH_sensor
TDS_Sensor = CMP-17439-000037-1: as Power_12V on sheet Power_supply; Series: XH; Contact Material: Brass; Mount: Through Hole; Housing Material: Polyamide; Contact Plating: Tin; Termination: Solder; Max Operating Temperature: 85°C; Depth: 5.75mm; Packaging: Bulk; Min Operating Temperature: -25°C; Contact Type: Male Pin; Color: Green; Pitch: 2.5mm; Length: 7.4mm; Lead Free: Lead Free; Number of Rows: 1; Fastening Type: Detent; Housing Color: White; Orientation: Straight
U4 = CMP-1086-00003-4: CMOS 14-Stage Ripple Carry Binary Counter / Divider and Oscillator, 3 to 18 V, -55 to 125 degC, 16-Pin SOIC (D), Green (RoHS & no Sb/Br), Tube; Manufacturer: Texas Instruments; VDD: 3 to 18 V; tPHL, tPLH (typ) @ 5 V: 370 ns; PartNumber: CD4060BM; ComponentLink3Description: Package Specification; ComponentLink1Description: Manufacturer URL; ComponentLink2URL: http://www.ti.com/lit/ds/symlink/cd4060b.pdf; Mounting Technology: Surface Mount; PackageDescription: 16-Pin Plastic Small-Outline Package, Body 9.9 x 3.9 mm, Pitch 1.27 mm; ComponentLink2Description: Datasheet; ComponentLink1URL: http://www.ti.com; PackageReference: D0016A; Temperature Range: -55 to 125 degC; ComponentLink3URL: http://www.ti.com/lit/ml/mpds178g/mpds178g.pdf; PackageVersion: 4040047-6/M; Note1: Green (RoHS & no Sb/Br); Packing: Tube; DatasheetVersion: SCHS049C
U5 = CMP-1685-00010-1: Quad Low-Voltage Rail-to-Rail Output Operational Amplifier, 2.7 to 5.5 V, -40 to 125 degC, 14-Pin SOIC (D), Green (RoHS & no Sb/Br), Tape and Reel; ComponentLink3Description: Package Specification; ComponentLink2URL: http://www.ti.com/lit/ds/symlink/lmv324.pdf; ComponentLink3URL: http://www.ti.com/lit/ml/mpds177g/mpds177g.pdf; DatasheetVersion: SLOS263W, 10/2014; ComponentLink1URL: http://www.ti.com/; Code_JEDEC: MS-012; ComponentLink1Description: Manufacturer URL; PackageDescription: 14-Pin Small Outline Integrated Circuit, Body 8.65 x 3.9 mm, Pitch 1.27 mm; PackageReference: D0014A; ComponentLink2Description: Datasheet

## Sheet Temp_sensor.SchDoc
size A4; SheetNumber: 4; SheetTotal: 7
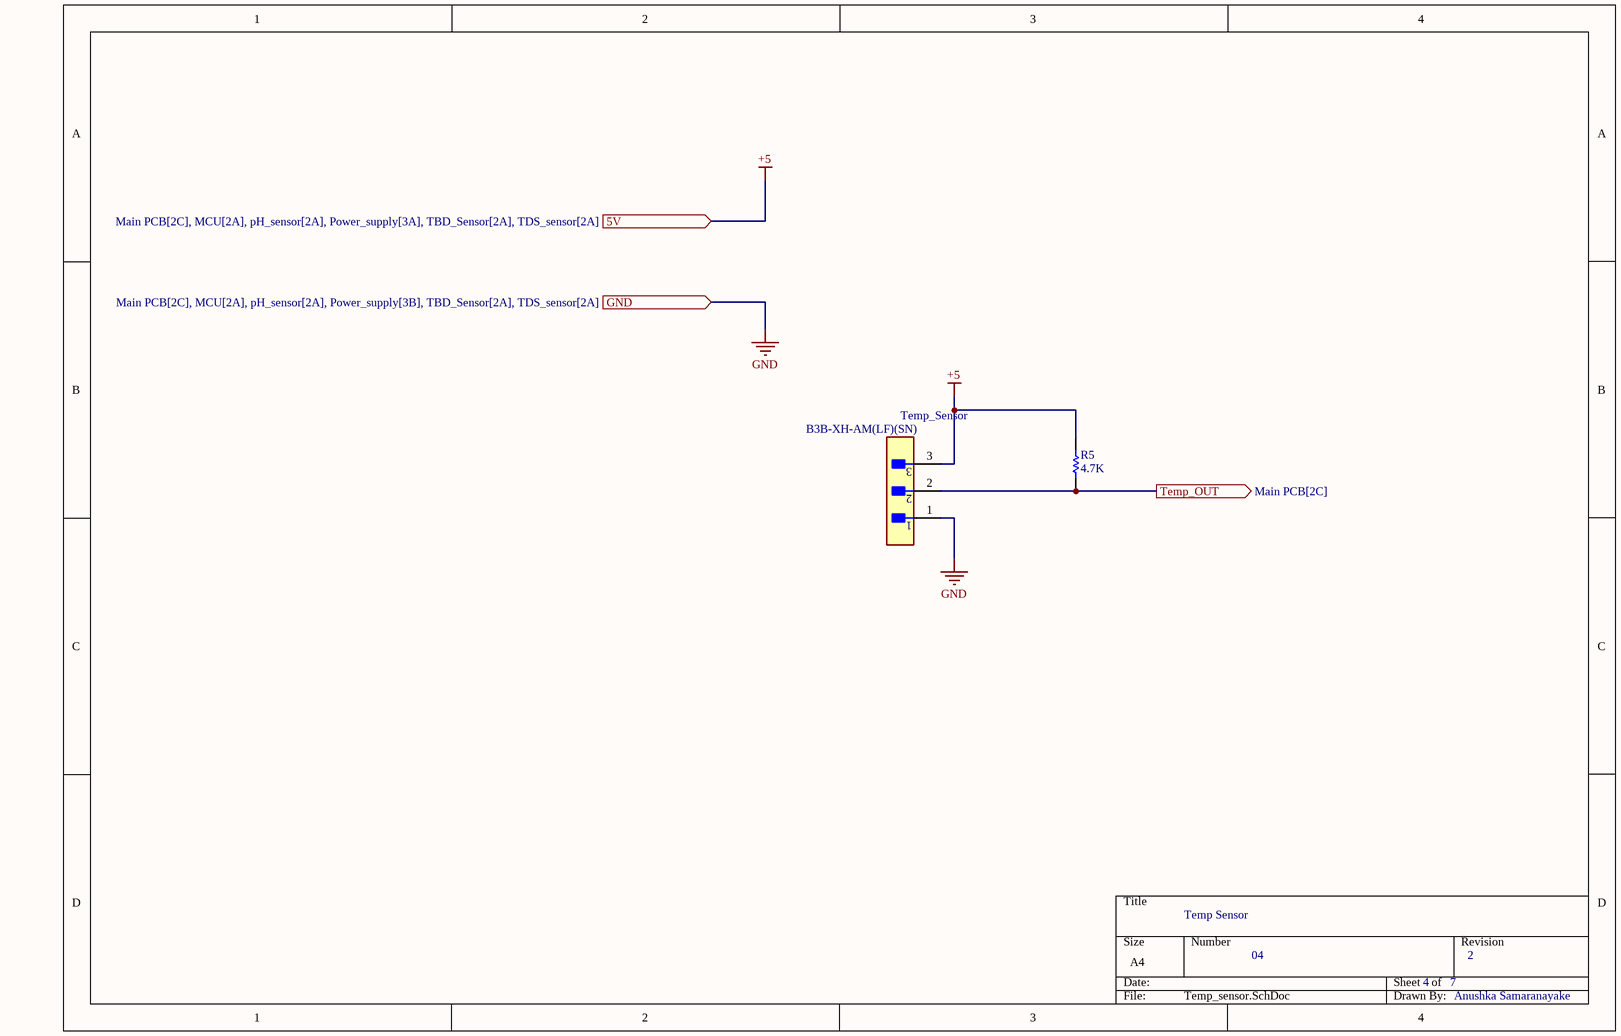
[diagram p5: Temp_sensor.SchDoc]

### Parts
R5  4.7K  [RESC3216X70X50LL20T25]
Temp_Sensor  B3B-XH-AM(LF)(SN)  [FP-B3B-XH-AM_LF_SN-MFG]

### Ports
5V (in, see Main PCB[2C], MCU[2A], pH_sensor[2A], Power_supply[3A], TBD_Sensor[2A], TDS_sensor[2A]), GND (in, see Main PCB[2C], MCU[2A], pH_sensor[2A], Power_supply[3B], TBD_Sensor[2A], TDS_sensor[2A]), Temp_OUT (out, see Main PCB[2C])

### Nets
+5: R5.1 Temp_Sensor.3 ; port 5V  [project net 5V]
GND: Temp_Sensor.1 ; port GND
NetMCU_17: R5.2 Temp_Sensor.2 ; port Temp_OUT

### Notes on the sheet
- Temp Sensor
- 04
- 4
- 7
- 2
- Anushka Samaranayake

### Library data of the parts
R5 = CMP-2003-04407-1: as R28 on sheet pH_sensor
Temp_Sensor = CMP-17438-000009-1: as TBD_Sensor on sheet TBD_Sensor; Termination: Press-Fit; Housing Color: White; Housing Material: Polyamide; Orientation: Straight; Contact Material: Brass; Contact Type: Male Pin; Color: Natural; Packaging: Bulk; Lead Free: Lead Free; Depth: 5.75mm; Number of Rows: 1; Contact Plating: Tin; Length: 9.9mm; Max Operating Temperature: 85°C; Series: XH; Min Operating Temperature: -25°C; Fastening Type: Detent; Mount: Through Hole

## Sheet MCU.SchDoc
size A4; SheetNumber: 3; SheetTotal: 7
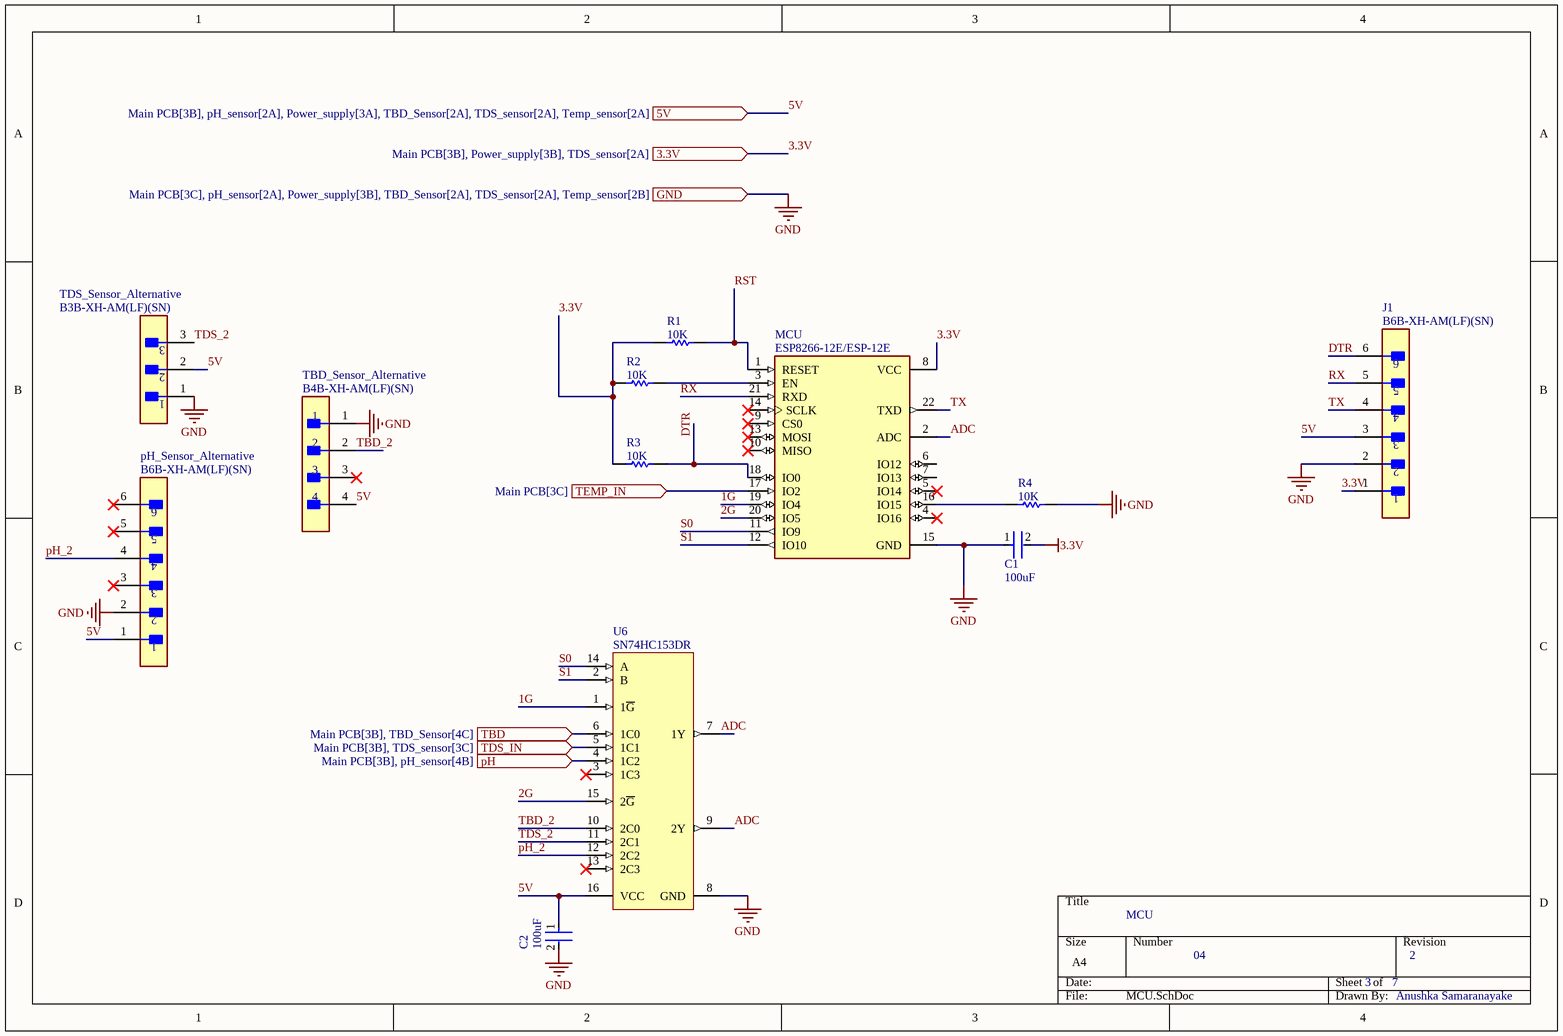
[diagram p6: MCU.SchDoc]

### Parts
C1  100uF  [FP-GRM31M-0_15-IPC_A]
C2  100uF  [FP-CL31-IPC_B]
J1  B6B-XH-AM(LF)(SN)  [FP-B6B-XH-AM_LF_SN-MFG]
MCU  ESP8266-12E/ESP-12E  [XCVR_ESP8266-12E/ESP-12E]
pH_Sensor_Alternative  B6B-XH-AM(LF)(SN)  [FP-B6B-XH-AM_LF_SN-MFG]
R1  10K  [RESC3216X70X50LL20T25]
R2  10K  [RESC3216X70X50LL20T25]
R3  10K  [RESC3216X70X50LL20T25]
R4  10K  [RESC3216X70X50LL20T25]
TBD_Sensor_Alternative  B4B-XH-AM(LF)(SN)  [FP-B4B-XH-AM_LF_SN-MFG]
TDS_Sensor_Alternative  B3B-XH-AM(LF)(SN)  [FP-B3B-XH-AM_LF_SN-MFG]
U6  SN74HC153DR  [D0016A_L]

### Ports
3.3V (in, see Main PCB[3B], Power_supply[3B], TDS_sensor[2A]), 5V (in, see Main PCB[3B], pH_sensor[2A], Power_supply[3A], TBD_Sensor[2A], TDS_sensor[2A], Temp_sensor[2A]), GND (in, see Main PCB[3C], pH_sensor[2A], Power_supply[3B], TBD_Sensor[2A], TDS_sensor[2A], Temp_sensor[2B]), pH (in, see Main PCB[3B], pH_sensor[4B]), TBD (in, see Main PCB[3B], TBD_Sensor[4C]), TDS_IN (in, see Main PCB[3B], TDS_sensor[3C]), TEMP_IN (in, see Main PCB[3C])

### Nets
3.3V: C1.2 J1.1 MCU.8(VCC) R1.2 R2.2 R3.2 ; port 3.3V
5V: C2.1 J1.3 pH_Sensor_Alternative.1 TBD_Sensor_Alternative.4 TDS_Sensor_Alternative.2 U6.16(VCC) ; port 5V
GND: C1.1 C2.2 J1.2 MCU.15(GND) pH_Sensor_Alternative.2 R4.1 TBD_Sensor_Alternative.1 TDS_Sensor_Alternative.1 U6.8(GND) ; port GND
1G: MCU.19(IO4) U6.1(1~{G})
2G: MCU.20(IO5) U6.15(2~{G})
ADC: MCU.2(ADC) U6.7(1Y) U6.9(2Y)
DTR: J1.6 MCU.18(IO0) R3.1
p_AOUT: U6.4(1C2) ; port pH
pH_2: pH_Sensor_Alternative.4 U6.12(2C2)
RST: MCU.1(RESET) R1.1
RX: J1.5 MCU.21(RXD)
S0: MCU.11(IO9) U6.14(A)
S1: MCU.12(IO10) U6.2(B)
Senser_OUT: U6.6(1C0) ; port TBD
TBD_2: TBD_Sensor_Alternative.2 U6.10(2C0)
TDS_2: TDS_Sensor_Alternative.3 U6.11(2C1)
TX: J1.4 MCU.22(TXD)
NetC25_2: U6.5(1C1) ; port TDS_IN
NetMCU_3: MCU.3(EN) R2.1
NetMCU_16: MCU.16(IO15) R4.2
NetMCU_17: MCU.17(IO2) ; port TEMP_IN

Not connected (* = marked no-connect by the designer): MCU 4(IO16)* 5(IO14)* 6(IO12) 7(IO13) 9(CS0)* 10(MISO)* 13(MOSI)* 14(SCLK)*; pH_Sensor_Alternative 3* 5* 6*; TBD_Sensor_Alternative 3*; U6 3(1C3)* 13(2C3)*

### Notes on the sheet
- MCU
- 04
- 3
- 7
- 2
- Anushka Samaranayake

### Library data of the parts
C1 = CMP-06035-007547-1: Chip Multilayer Ceramic Capacitors for General Purpose, 1206, 0.10uF, SL, +350/-1000ppm/°C, 5%, 50V; Capacitance: 100nF; Dissipation Factor: 0.025%; Packaging: Tape and Reel; Length: 0.126inch; Case Code (Imperial): 1206; Voltage Rating (DC): 50V; Max Operating Temperature: 125°C; Voltage: 50V; Height: 1.15mm; Width: 0.063inch; Voltage Rating: 50V; Tolerance: 5%; Min Operating Temperature: -55°C; Mount: Surface Mount; Dielectric Material: Ceramic; Termination: SMD/SMT; Depth: 1.6mm; Case Code (Metric): 3216; Case/Package: 1206; Temperature Coefficient: -1000ppm/°C; Thickness: 0.049inch
C2 = CMP-13271-001731-1: as C3 on sheet Power_supply; Voltage: 50V; Thickness: 0.037inch; Lead Free: Lead Free; Length: 3.2mm; Min Operating Temperature: -55°C; Package Quantity: 15000; Packaging: Tape and Reel; Mount: Surface Mount; Depth: 1.6mm; Case/Package: 1206; Voltage Rating (DC): 50V; Tolerance: 10%; Height: 0.85mm; Capacitance: 100nF; Radiation Hardening: No; Dielectric: X7R; Voltage Rating: 50V; Max Operating Temperature: 125°C; Width: 0.063inch
J1 pH_Sensor_Alternative = CMP-17439-000167-1: CONN HEADER VERT 6POS 2.5MM; Shape: Straight; Current Rating: 3A; Mated Stacking Heights: 9.8mm; Number of Positions: 6; Voltage Rating: 250V; Pitch: 2.5mm; Insulation Color: Natural; Number of Pins: 6; Width: 5.75mm; Flammability Rating: UL94 V-0; Packaging: Bulk; Connector Type: Header; Number of Rows: 1; Contact Plating: Copper; Mount: Through Hole; Min Operating Temperature: -25°C; Contact Type: Male Pin; Contact Shape: Square; Fastening Type: Detent; Length: 17.4mm; Series: XH; Contact Finish - Mating: TIN; Max Operating Temperature: 85°C; Insulation Material: Nylon; Number of Poles: 6; Termination: Press-Fit; Contact Material: Brass; Height: 7mm
MCU = ESP8266-12E/ESP-12E: This WiFi module has a 32-bit MCU micro and clock speeds supporting 80 MHz or 160 MHz. Supports the RTOS and integrated Wi-Fi MAC/BB/RF/PA/LNA, and has an on-board antenna.; MF: AI-Thinker; Value: *; SnapEDA_Link: https://www.snapeda.com/parts/ESP8266-12E/ESP-12E/AI-Thinker/view-part/?ref=snap; Availability: Not in stock; Price: None; Package: None; Check_prices: https://www.snapeda.com/parts/ESP8266-12E/ESP-12E/AI-Thinker/view-part/?ref=eda; MP: ESP8266-12E/ESP-12E
R1-R4 = CMP-2003-04407-1: as R28 on sheet pH_sensor
TBD_Sensor_Alternative = CMP-17439-000301-1: CONN HEADER VERT 4POS 2.5MM
TDS_Sensor_Alternative = CMP-17438-000009-1: as TBD_Sensor on sheet TBD_Sensor; Termination: Press-Fit; Housing Color: White; Housing Material: Polyamide; Orientation: Straight; Contact Material: Brass; Contact Type: Male Pin; Color: Natural; Packaging: Bulk; Lead Free: Lead Free; Depth: 5.75mm; Number of Rows: 1; Contact Plating: Tin; Length: 9.9mm; Max Operating Temperature: 85°C; Series: XH; Min Operating Temperature: -25°C; Fastening Type: Detent; Mount: Through Hole
U6 = CMP-1628-00005-2: Dual 4-Line To 1-Line Data Selectors/Multiplexers, D0016A, LARGE T&R; Manufacturer: Texas Instruments; tpd @ Nom Voltage(Max)(ns): 38; Configuration: 4：1; Channels(#): 2; Bits(#): 4; Function: Encoder/Multiplexer; Input Type: LVTTL/CMOS; VCC(Max)(V): 6; ICC @ Nom Voltage(Max)(mA): 8; Output Type: CMOS; Output Drive (IOL/IOH)(Max)(mA): 7.8/-7.8; Technology Family: HC; F @ Nom Voltage(Max)(Mhz): 28; Schmitt Trigger: No; Rating: Catalog; Voltage(Nom)(V): 3.3,5; Code_JEDEC: MS-012 variation AC; Operating Temperature Range(C): -40 to 85; DatasheetVersion: SCLS112D; Type: Standard; VCC(Min)(V): 2; Generic Part Number: SN74HC153; PackageReference: D0016A

## Nets that join several sheets
3.3V: Power_supply (6 pins), TDS_sensor (5 pins), MCU (6 pins)
5V: Power_supply (C4.2 U8.1), pH_sensor (11 pins), TBD_Sensor (6 pins), TDS_sensor (R21.1), Temp_sensor (R5.1 Temp_Sensor.3), MCU (6 pins)
-3.3V: Power_supply (C12.1 C13.1 U10.1), TDS_sensor (6 pins)
GND: Power_supply (14 pins), pH_sensor (20 pins), TBD_Sensor (8 pins), TDS_sensor (13 pins), Temp_sensor (Temp_Sensor.1), MCU (9 pins)
NetC25_2: TDS_sensor (C25.2 D6.2 R24.1), MCU (U6.5)
NetMCU_17: Temp_sensor (R5.2 Temp_Sensor.2), MCU (MCU.17)
p_AOUT: pH_sensor (R28.2 R49.1 U1.1), MCU (U6.4)
Senser_OUT: TBD_Sensor (SW1.2), MCU (U6.6)